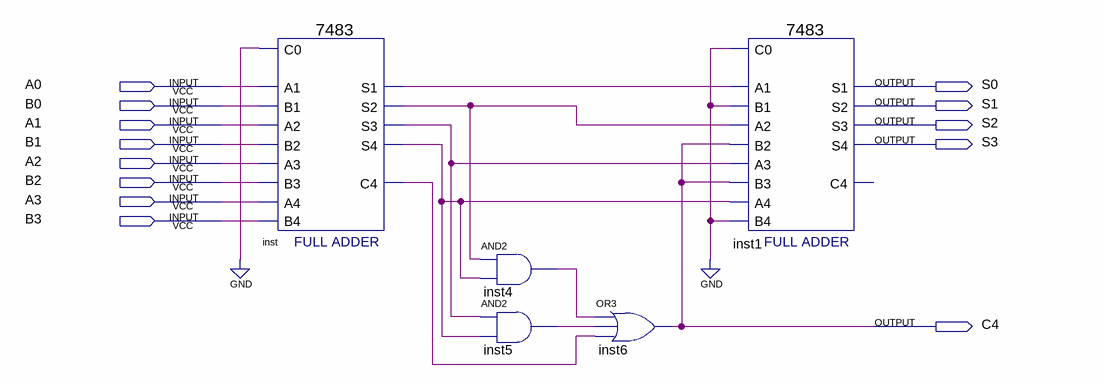
[diagram p0: schematic sheet]
// Quartus schematic BCD_adder_7483.bdf as structural Verilog: 5 symbols, 13 pins
module BCD_adder_7483 (
  input  A0,
  input  B0,
  input  A1,
  input  B1,
  input  A2,
  input  B2,
  input  A3,
  input  B3,
  output S0,
  output S1,
  output S2,
  output S3,
  output C4
);

  wire inst4_out, inst5_out, inst_c4, inst_s1, inst_s2, inst_s3, inst_s4;

  \7483  inst (
    .B4(B3), .C0(1'b0), .A1(A0), .A2(A1), .B1(B0), .B2(B1), .A3(A2), .B3(B2), .A4(A3), .S3(inst_s3),
    .S4(inst_s4), .S2(inst_s2), .C4(inst_c4), .S1(inst_s1));
  and inst4 (inst4_out, inst_s2, inst_s4);
  and inst5 (inst5_out, inst_s3, inst_s4);
  or inst6 (C4, inst4_out, inst5_out, inst_c4);
  \7483  inst1 (
    .B4(1'b0), .C0(1'b0), .A1(inst_s1), .A2(inst_s2), .B1(1'b0), .B2(C4), .A3(inst_s3), .B3(C4),
    .A4(inst_s4), .S3(S2), .S4(S3), .S2(S1), .S1(S0));  // open: C4
endmodule
